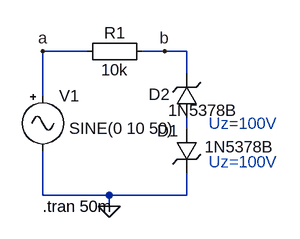
[diagram p0: schematic question_b.asc]
question_b.asc, the LTspice schematic file:
Version 4
SHEET 1 880 680
WIRE 16 112 -48 112
WIRE 128 112 96 112
WIRE 160 112 128 112
WIRE 160 144 160 112
WIRE -48 176 -48 112
WIRE 160 224 160 208
WIRE -48 320 -48 256
WIRE 48 320 -48 320
WIRE 160 320 160 288
WIRE 160 320 48 320
WIRE 48 336 48 320
FLAG -48 112 a
FLAG 48 336 0
FLAG 128 112 b
SYMBOL zener 144 224 R0
WINDOW 0 -27 3 Left 2
WINDOW 3 42 26 Left 2
SYMATTR InstName D1
SYMATTR Value 1N5378B
SYMATTR Description Diode
SYMATTR Type diode
SYMBOL Misc\\signal -48 160 R0
WINDOW 123 0 0 Left 2
WINDOW 39 0 0 Left 2
WINDOW 3 38 63 Left 2
SYMATTR Value SINE(0 10 50)
SYMATTR InstName V1
SYMBOL Misc\\EuropeanResistor 112 96 R90
WINDOW 0 5 56 VBottom 2
WINDOW 3 27 56 VTop 2
SYMATTR InstName R1
SYMATTR Value 10k
SYMBOL zener 176 208 R180
WINDOW 0 40 34 Left 2
WINDOW 3 -58 11 Left 2
SYMATTR InstName D2
SYMATTR Value 1N5378B
SYMATTR Description Diode
SYMATTR Type diode
TEXT -48 336 Left 2 !.tran 50m
TEXT 192 272 Left 2 ;Uz=100V
TEXT 192 216 Left 2 ;Uz=100V

The netlist it stands for:
* question_b.asc
D1 N001 0 1N5378B
V1 a 0 SINE(0 10 50)
R1 b a 10k
D2 N001 b 1N5378B
.model D D
.lib standard.dio
.tran 50m
* Uz=100V
* Uz=100V
.backanno
.end